# EasyEDA Pro project SCH_and_PCB.epro, schematic STC32G无刷电调aht
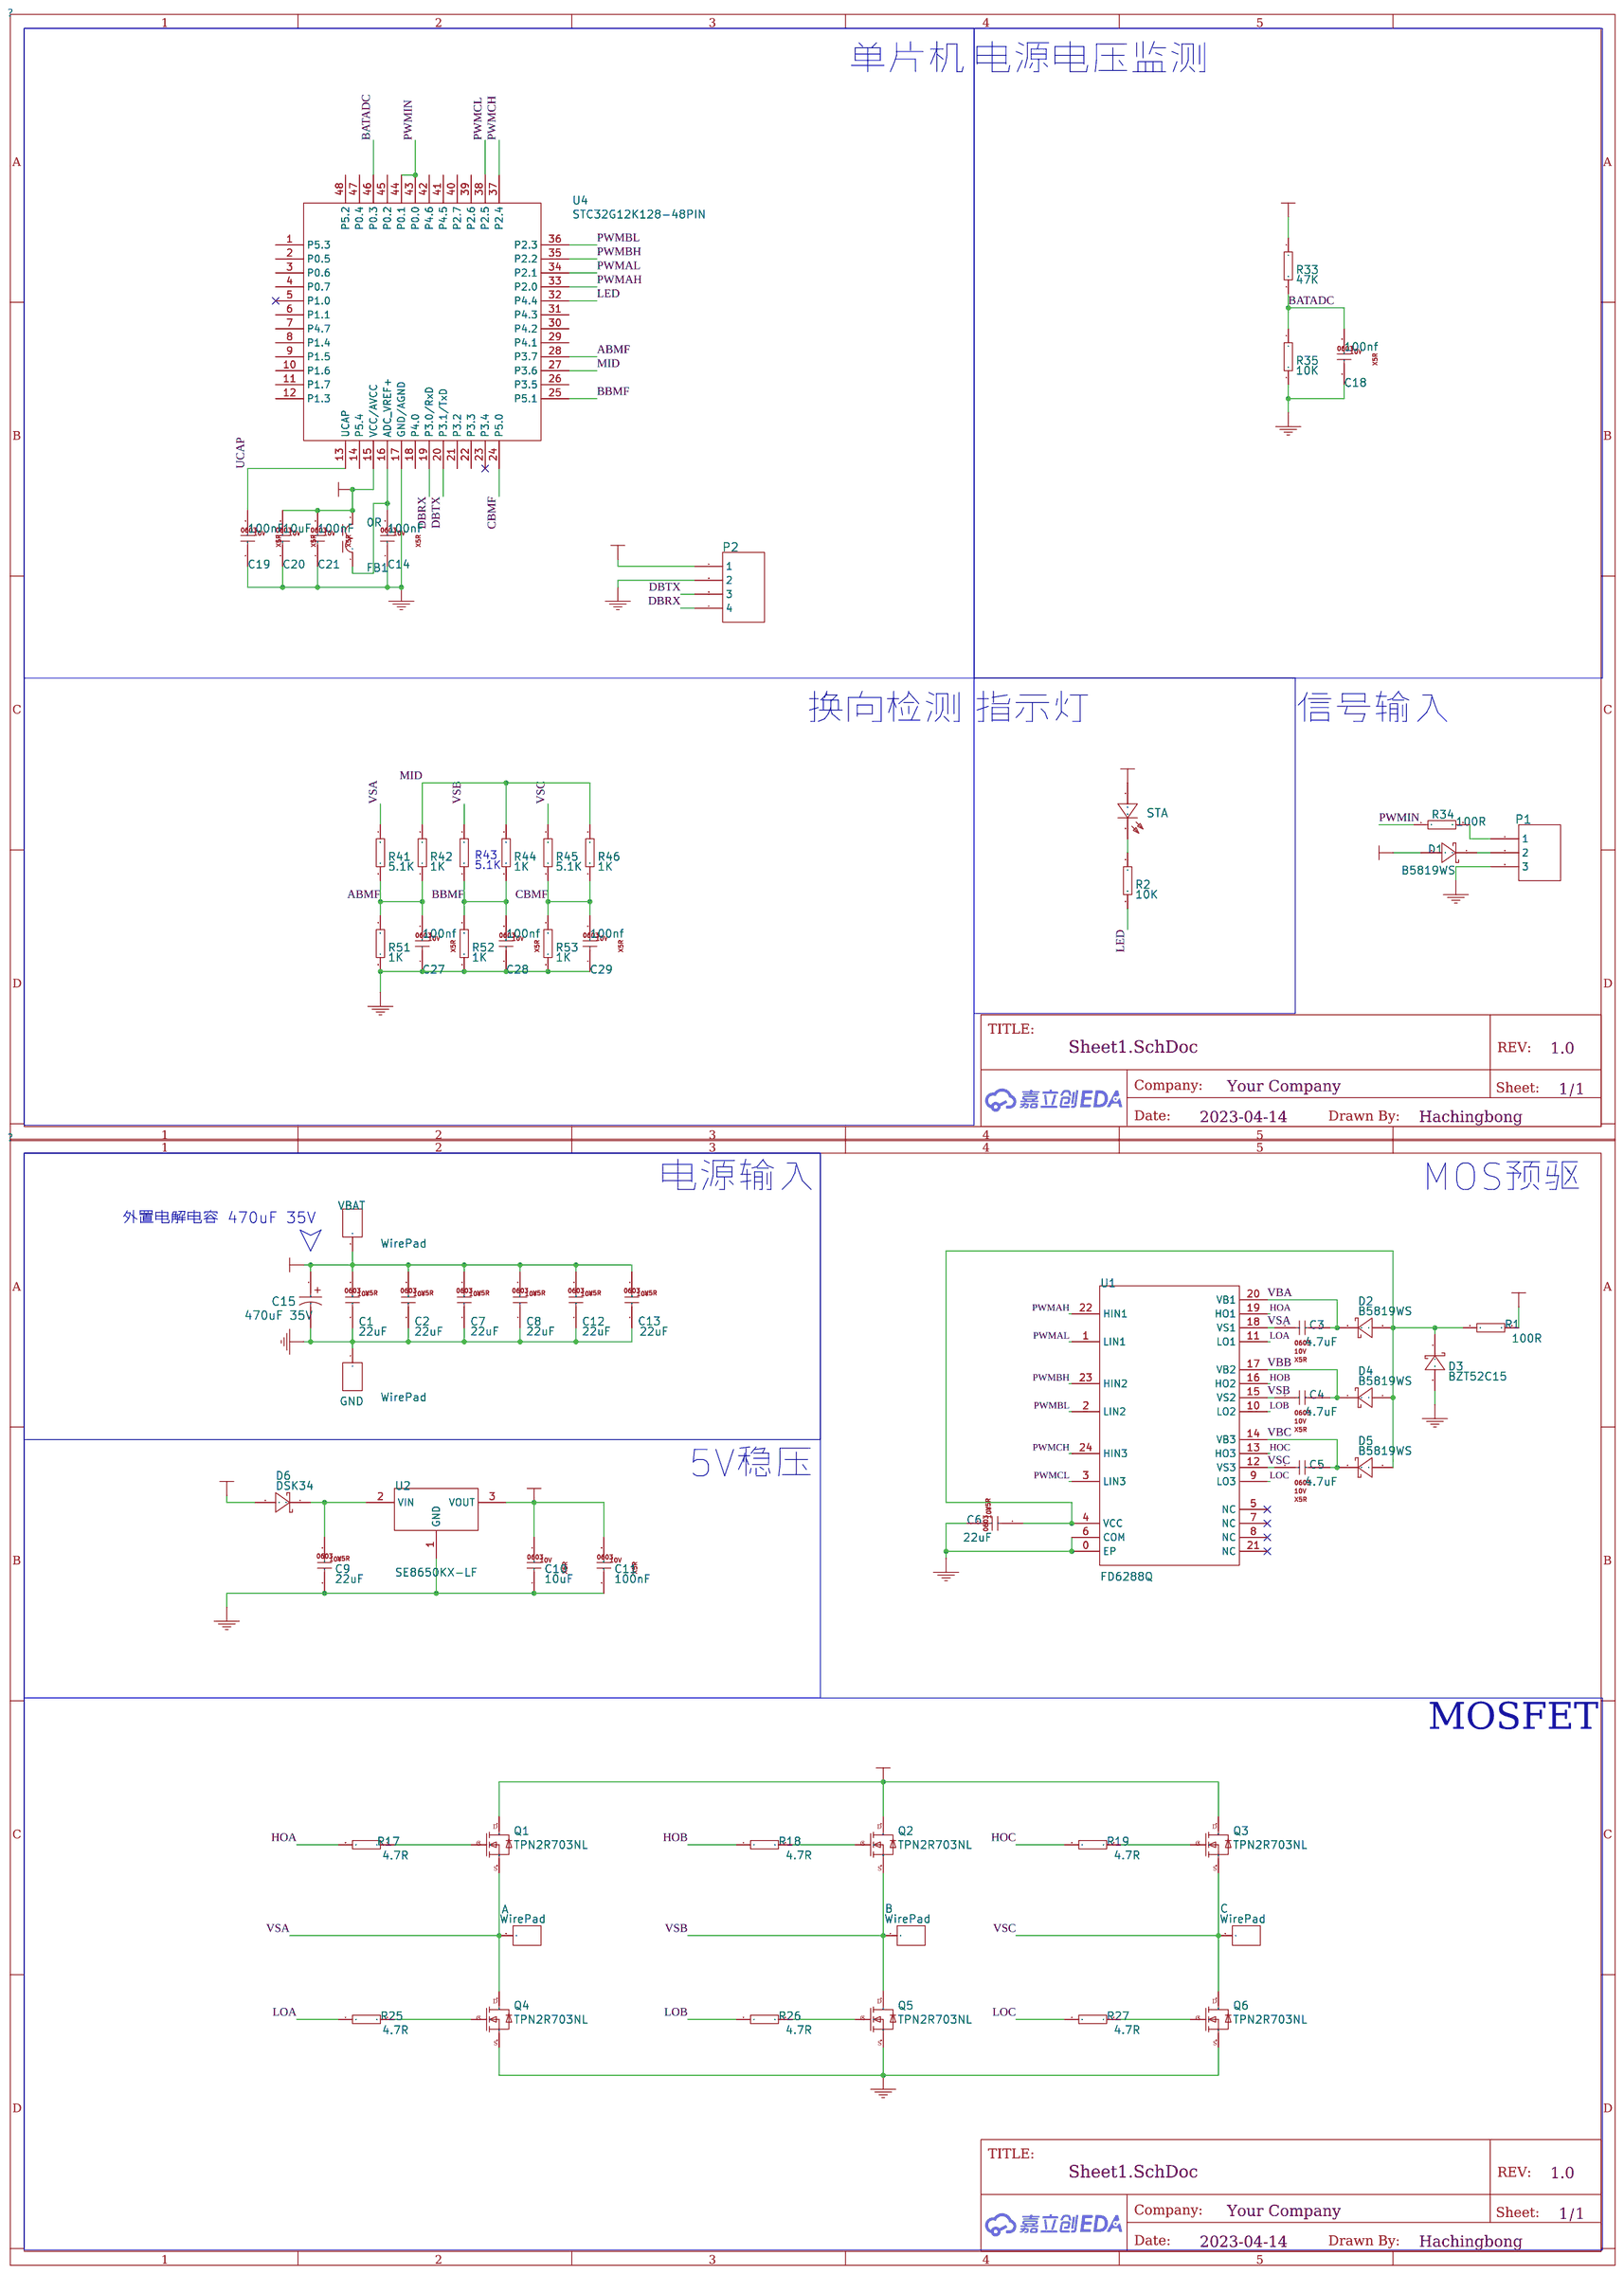
[diagram p1: schematic sheet]

## Parts
A  WirePad  [WIREPAD-4.5X7]
B  WirePad  [WIREPAD-4.5X7]
C  WirePad  [WIREPAD-4.5X7]
C1  22uF  [CAPC1608[0603]S-N]
C2  22uF  [CAPC1608[0603]S-N]
C3  4.7uF  [CAPC1608[0603]S-N]
C4  4.7uF  [CAPC1608[0603]S-N]
C5  4.7uF  [CAPC1608[0603]S-N]
C6  22uF  [CAPC1608[0603]S-N]
C7  22uF  [CAPC1608[0603]S-N]
C8  22uF  [CAPC1608[0603]S-N]
C9  22uF  [CAPC1608[0603]S-N]
C10  10uF  [CAPC1608[0603]S-N]
C11  100nF  [CAPC1608[0603]S-N]
C12  22uF  [CAPC1608[0603]S-N]
C13  22uF  [CAPC1608[0603]S-N]
C14  100nF  [CAPC1608[0603]S-N]
C15  470uF 35V  [CAPPR5-8X12]
C18  100nf  [CAPC1608[0603]S-N]
C19  100nF  [CAPC1608[0603]S-N]
C20  10uF  [CAPC1608[0603]S-N]
C21  100nF  [CAPC1608[0603]S-N]
C27  100nf  [CAPC1608[0603]S-N]
C28  100nf  [CAPC1608[0603]S-N]
C29  100nf  [CAPC1608[0603]S-N]
D1  B5819WS  [SOD-123-L]
D2  B5819WS  [SOD-123-L]
D3  BZT52C15  [SOD-123-L]
D4  B5819WS  [SOD-123-L]
D5  B5819WS  [SOD-123-L]
D6  DSK34  [SOD-123-L]
FB1  0R  [INDC1005[0402]S]
GND  WirePad  [WIREPAD-4.5X7]
P1  Header 3  [HDR1X3-TP]
P2  Header 4  [HDR1X4-TP]
Q1  TPN2R703NL  [TSON3X3]
Q2  TPN2R703NL  [TSON3X3]
Q3  TPN2R703NL  [TSON3X3]
Q4  TPN2R703NL  [TSON3X3]
Q5  TPN2R703NL  [TSON3X3]
Q6  TPN2R703NL  [TSON3X3]
R1  100R  [RESC1005[0402]S-N]
R2  10K  [CAPC1608[0603]S-N]
R17  4.7R  [CAPC1608[0603]S-N]
R18  4.7R  [CAPC1608[0603]S-N]
R19  4.7R  [CAPC1608[0603]S-N]
R25  4.7R  [CAPC1608[0603]S-N]
R26  4.7R  [CAPC1608[0603]S-N]
R27  4.7R  [CAPC1608[0603]S-N]
R33  47K  [CAPC1608[0603]S-N]
R34  100R  [CAPC1608[0603]S-N]
R35  10K  [CAPC1608[0603]S-N]
R41  5.1K  [CAPC1608[0603]S-N]
R42  1K  [CAPC1608[0603]S-N]
R43  47K  [CAPC1608[0603]S-N]
R44  1K  [CAPC1608[0603]S-N]
R45  5.1K  [CAPC1608[0603]S-N]
R46  1K  [CAPC1608[0603]S-N]
R51  1K  [CAPC1608[0603]S-N]
R52  1K  [CAPC1608[0603]S-N]
R53  1K  [CAPC1608[0603]S-N]
STA  LED Chip Blue  [LEDC1608(0603)-L]
U1  FD6288Q  [QFN24-4X4]
U2  SE8650KX-LF  [SOT-89[T0243AA][SC62]-L]
U4  STC32G12K128-48PIN  [LQFP48_L]
VBAT  WirePad  [WIREPAD-4.5X7]

## Library data of the parts
A B C GND VBAT = WirePad
C1 C2 C7 C8 C12 C13 = 22uF: Revision: V1.0; Voltage: 25V; Type: X5R
C3-C5 = 4.7uF: Revision: V1.0; Voltage: 10V; Type: X5R
C6 C9 = 22uF: Revision: V1.0; Voltage: 10V; Type: X5R
C10 C20 = 10uF: Revision: V1.0; Voltage: 10V; Type: X5R
C11 C14 C19 C21 = 100nF: Revision: V1.0; Voltage: 10V; Type: X5R
C15 = 470uF 35V: Revision: V1.0; Type: 铝电解; Voltage: 35V
C18 C27-C29 = 100nf: Revision: V1.0; Voltage: 10V; Type: X5R
D1 D2 D4 D5 = B5819WS: Published: 8-Jun-2000; Revision: July-2002: Re-released for DXP Platform.; Publisher: Altium Limited; Price(RMB): 0.000; Imax: 500mA
D3 = BZT52C15: Published: 8-Jun-2000; Revision: July-2002: Re-released for DXP Platform.; Publisher: Altium Limited; Price(RMB): 0.000; Imax: 500mA
D6 = DSK34: Published: 8-Jun-2000; Revision: July-2002: Re-released for DXP Platform.; Publisher: Altium Limited; Price(RMB): 0.000; Imax: 500mA
FB1 = 0R: Published: 2020-12-18; Revision: V1.0; DCR: .1m; Frequency: @100MHz; Imax: 500mA
P1 = Header 3: LatestRevisionDate: 17-Jul-2002; LatestRevisionNote: Re-released for DXP Platform.; Publisher: Altium Limited; Price(RMB): 0.00
P2 = Header 4: LatestRevisionDate: 17-Jul-2002; LatestRevisionNote: Re-released for DXP Platform.; Publisher: Altium Limited; Price(RMB): 0.00
Q1-Q6 = TPN2R703NL
R1 R34 = 100R: Revision: V1.0; Power: 1/8W; Tolerance: ±1%
R2 R35 = 10K: Revision: V1.0; Power: 1/8W; Tolerance: ±1%
R17-R19 R25-R27 = 4.7R: Revision: V1.0; Power: 1/8W; Tolerance: ±1%
R33 R43 = 47K: Revision: V1.0; Power: 1/8W; Tolerance: ±1%
R41 R45 = 5.1K: Revision: V1.0; Power: 1/8W; Tolerance: ±1%
R42 R44 R46 R51-R53 = 1K: Revision: V1.0; Power: 1/8W; Tolerance: ±1%
STA = LED Chip Blue: Published: 8-Jun-2000; Revision: July-2002: Re-released for DXP Platform.; Publisher: Altium Limited; Price(RMB): 0.00; Color: Blue
U1 = FD6288Q
U2 = SE8650KX-LF
U4 = STC32G12K128-48PIN

## Nets
GND: C1.1 C2.1 C6.2 C7.1 C8.1 C9.1 C10.1 C11.1 C12.1 C13.1 C14.1 C15.2 C18.1 C19.1 C20.1 C21.1 C27.1 C28.1 C29.1 D3.A GND.1 P1.3 P2.2 Q4.3(S) Q5.3(S) Q6.3(S) R35.2 R51.2 R52.2 R53.2 U1.0(EP) U1.6(COM) U2.1(GND) U4.17(GND/AGND)
VBAT: C1.2 C2.2 C7.2 C8.2 C12.2 C13.2 C15.1 D6.A Q1.1(D) Q2.1(D) Q3.1(D) R1.2 R33.1 VBAT.1
VCC5V: C10.2 C11.2 C20.2 C21.2 D1.A FB1.2 P2.1 STA.A U2.3(VOUT) U4.15(VCC/AVCC)
ABMF: C27.2 R41.2 R42.2 R51.1 U4.28(P3.7)
BATADC: C18.2 R33.2 R35.1 U4.46(P0.3)
BBMF: C28.2 R43.2 R44.2 R52.1 U4.25(P5.1)
CBMF: C29.2 R45.2 R46.2 R53.1 U4.24(P5.0)
DBRX: P2.4 U4.19(P3.0/RxD)
DBTX: P2.3 U4.20(P3.1/TxD)
HOA: R17.2 U1.19(HO1)
HOB: R18.1 U1.16(HO2)
HOC: R19.1 U1.13(HO3)
LED: R2.2 U4.32(P4.4)
LOA: R25.1 U1.11(LO1)
LOB: R26.1 U1.10(LO2)
LOC: R27.1 U1.9(LO3)
MID: R42.1 R44.1 R46.1 U4.27(P3.6)
PWMAH: U1.22(HIN1) U4.33(P2.0)
PWMAL: U1.1(LIN1) U4.34(P2.1)
PWMBH: U1.23(HIN2) U4.35(P2.2)
PWMBL: U1.2(LIN2) U4.36(P2.3)
PWMCH: U1.24(HIN3) U4.37(P2.4)
PWMCL: U1.3(LIN3) U4.38(P2.5)
PWMIN: R34.1 U4.43(P0.0) U4.44(P0.1)
UCAP: C19.2 U4.13(UCAP)
VBA: C3.2 D2.K U1.20(VB1)
VBB: C4.2 D4.K U1.17(VB2)
VBC: C5.2 D5.K U1.14(VB3)
VSA: A.1 C3.1 Q1.3(S) Q4.1(D) R41.1 U1.18(VS1)
VSB: B.1 C4.1 Q2.3(S) Q5.1(D) R43.1 U1.15(VS2)
VSC: C.1 C5.1 Q3.3(S) Q6.1(D) R45.1 U1.12(VS3)
Net-(C6-1): C6.1 D2.A D3.K D4.A D5.A R1.1 U1.4(VCC)
Net-(C9-2): C9.2 D6.K U2.2(VIN)
Net-(C14-2): C14.2 FB1.1 U4.16(ADC_VREF+)
Net-(D1-K): D1.K P1.2
Net-(P1-1): P1.1 R34.2
Net-(Q1-2): Q1.2(G) R17.1
Net-(Q2-2): Q2.2(G) R18.2
Net-(Q3-2): Q3.2(G) R19.2
Net-(Q4-2): Q4.2(G) R25.2
Net-(Q5-2): Q5.2(G) R26.2
Net-(Q6-2): Q6.2(G) R27.2
Net-(R2-1): R2.1 STA.C

Not connected (* = marked no-connect by the designer): U1 5(NC)* 7(NC)* 8(NC)* 21(NC)*; U4 1(P5.3) 2(P0.5) 3(P0.6) 4(P0.7) 5(P1.0)* 6(P1.1) 7(P4.7) 8(P1.4) 9(P1.5) 10(P1.6) 11(P1.7) 12(P1.3) 14(P5.4) 18(P4.0) 21(P3.2) 22(P3.3) 23(P3.4)* 26(P3.5) 29(P4.1) 30(P4.2) 31(P4.3) 39(P2.6) 40(P2.7) 41(P4.5) 42(P4.6) 45(P0.2) 47(P0.4) 48(P5.2)

## Notes on the sheet
- 单片机
- 电源电压监测
- 换向检测
- 指示灯
- 信号输入
- R43
- 5.1K
- 电源输入
- MOS预驱
- 外置电解电容 470uF 35V
- 5V稳压
- MOSFET
